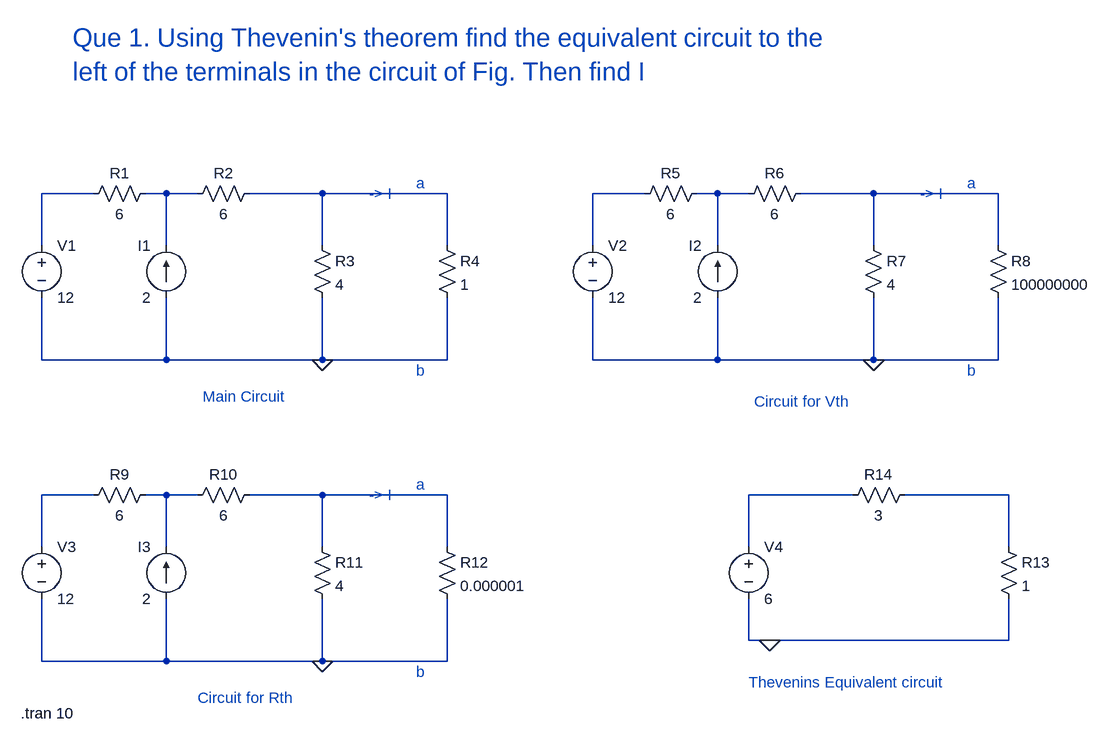
[diagram p0: schematic 1_Dheerendra_23EE019_Thevenins.asc]
1_Dheerendra_23EE019_Thevenins.asc, the LTspice schematic file:
Version 4
SHEET 1 940 960
WIRE -608 144 -688 144
WIRE -496 144 -528 144
WIRE -448 144 -496 144
WIRE -256 144 -368 144
WIRE -64 144 -256 144
WIRE 240 144 160 144
WIRE 352 144 320 144
WIRE 400 144 352 144
WIRE 592 144 480 144
WIRE 784 144 592 144
WIRE -688 224 -688 144
WIRE -496 224 -496 144
WIRE -256 224 -256 144
WIRE -64 224 -64 144
WIRE 160 224 160 144
WIRE 352 224 352 144
WIRE 592 224 592 144
WIRE 784 224 784 144
WIRE -688 400 -688 304
WIRE -496 400 -496 304
WIRE -496 400 -688 400
WIRE -256 400 -256 304
WIRE -256 400 -496 400
WIRE -64 400 -64 304
WIRE -64 400 -256 400
WIRE 160 400 160 304
WIRE 352 400 352 304
WIRE 352 400 160 400
WIRE 592 400 592 304
WIRE 592 400 352 400
WIRE 784 400 784 304
WIRE 784 400 592 400
WIRE -608 608 -688 608
WIRE -496 608 -528 608
WIRE -448 608 -496 608
WIRE -256 608 -368 608
WIRE -64 608 -256 608
WIRE 560 608 400 608
WIRE 800 608 640 608
WIRE -688 688 -688 608
WIRE -496 688 -496 608
WIRE -256 688 -256 608
WIRE -64 688 -64 608
WIRE 400 688 400 608
WIRE 800 688 800 608
WIRE 400 832 400 768
WIRE 432 832 400 832
WIRE 800 832 800 768
WIRE 800 832 432 832
WIRE -688 864 -688 768
WIRE -496 864 -496 768
WIRE -496 864 -688 864
WIRE -256 864 -256 768
WIRE -256 864 -496 864
WIRE -64 864 -64 768
WIRE -64 864 -256 864
FLAG -256 400 0
FLAG 592 400 0
FLAG -256 864 0
FLAG 432 832 0
SYMBOL res -512 128 R90
WINDOW 0 0 56 VBottom 2
WINDOW 3 32 56 VTop 2
SYMATTR InstName R1
SYMATTR Value 6
SYMBOL res -352 128 R90
WINDOW 0 0 56 VBottom 2
WINDOW 3 32 56 VTop 2
SYMATTR InstName R2
SYMATTR Value 6
SYMBOL res -272 208 R0
SYMATTR InstName R3
SYMATTR Value 4
SYMBOL res -80 208 R0
SYMATTR InstName R4
SYMATTR Value 1
SYMBOL voltage -688 208 R0
WINDOW 123 0 0 Left 0
WINDOW 39 0 0 Left 0
SYMATTR InstName V1
SYMATTR Value 12
SYMBOL current -496 304 R180
WINDOW 0 24 80 Left 2
WINDOW 3 24 0 Left 2
WINDOW 123 0 0 Left 0
WINDOW 39 0 0 Left 0
SYMATTR InstName I1
SYMATTR Value 2
SYMBOL res 336 128 R90
WINDOW 0 0 56 VBottom 2
WINDOW 3 32 56 VTop 2
SYMATTR InstName R5
SYMATTR Value 6
SYMBOL res 496 128 R90
WINDOW 0 0 56 VBottom 2
WINDOW 3 32 56 VTop 2
SYMATTR InstName R6
SYMATTR Value 6
SYMBOL res 576 208 R0
SYMATTR InstName R7
SYMATTR Value 4
SYMBOL res 768 208 R0
SYMATTR InstName R8
SYMATTR Value 100000000
SYMBOL voltage 160 208 R0
WINDOW 123 0 0 Left 0
WINDOW 39 0 0 Left 0
SYMATTR InstName V2
SYMATTR Value 12
SYMBOL current 352 304 R180
WINDOW 0 24 80 Left 2
WINDOW 3 24 0 Left 2
WINDOW 123 0 0 Left 0
WINDOW 39 0 0 Left 0
SYMATTR InstName I2
SYMATTR Value 2
SYMBOL res -512 592 R90
WINDOW 0 0 56 VBottom 2
WINDOW 3 32 56 VTop 2
SYMATTR InstName R9
SYMATTR Value 6
SYMBOL res -352 592 R90
WINDOW 0 0 56 VBottom 2
WINDOW 3 32 56 VTop 2
SYMATTR InstName R10
SYMATTR Value 6
SYMBOL res -272 672 R0
SYMATTR InstName R11
SYMATTR Value 4
SYMBOL res -80 672 R0
SYMATTR InstName R12
SYMATTR Value 0.000001
SYMBOL voltage -688 672 R0
WINDOW 123 0 0 Left 0
WINDOW 39 0 0 Left 0
SYMATTR InstName V3
SYMATTR Value 12
SYMBOL current -496 768 R180
WINDOW 0 24 80 Left 2
WINDOW 3 24 0 Left 2
WINDOW 123 0 0 Left 0
WINDOW 39 0 0 Left 0
SYMATTR InstName I3
SYMATTR Value 2
SYMBOL res 784 672 R0
SYMATTR InstName R13
SYMATTR Value 1
SYMBOL res 656 592 R90
WINDOW 0 0 56 VBottom 2
WINDOW 3 32 56 VTop 2
SYMATTR InstName R14
SYMATTR Value 3
SYMBOL voltage 400 672 R0
WINDOW 123 0 0 Left 0
WINDOW 39 0 0 Left 0
SYMATTR InstName V4
SYMATTR Value 6
TEXT -640 -96 Left 4 ;Que 1. Using Thevenin's theorem find the equivalent circuit to the \nleft of the terminals in the circuit of Fig. Then find I
TEXT -112 128 Left 2 ;a
TEXT -112 416 Left 2 ;b
TEXT -184 144 Left 2 ;-> I
TEXT 736 128 Left 2 ;a
TEXT 736 416 Left 2 ;b
TEXT 664 144 Left 2 ;-> I
TEXT -112 592 Left 2 ;a
TEXT -112 880 Left 2 ;b
TEXT -184 608 Left 2 ;-> I
TEXT -440 456 Left 2 ;Main Circuit
TEXT 408 464 Left 2 ;Circuit for Vth
TEXT -448 920 Left 2 ;Circuit for Rth
TEXT 400 896 Left 2 ;Thevenins Equivalent circuit
TEXT -720 944 Left 2 !.tran 10

The netlist it stands for:
* 1_Dheerendra_23EE019_Thevenins.asc
R1 N002 N001 6
R2 N003 N002 6
R3 N003 0 4
R4 N003 0 1
V1 N001 0 12
I1 0 N002 2
R5 N005 N004 6
R6 N006 N005 6
R7 N006 0 4
R8 N006 0 100000000
V2 N004 0 12
I2 0 N005 2
R9 N008 N007 6
R10 N009 N008 6
R11 N009 0 4
R12 N009 0 0.000001
V3 N007 0 12
I3 0 N008 2
R13 N011 0 1
R14 N011 N010 3
V4 N010 0 6
* Que 1. Using Thevenin's theorem find the equivalent circuit to the
* left of the terminals in the circuit of Fig. Then find I
* a
* b
* -> I
* a
* b
* -> I
* a
* b
* -> I
* Main Circuit
* Circuit for Vth
* Circuit for Rth
* Thevenins Equivalent circuit
.tran 10
.backanno
.end